# Altium schematic sheet Iso_SPI_PHY.SchDoc
size A4
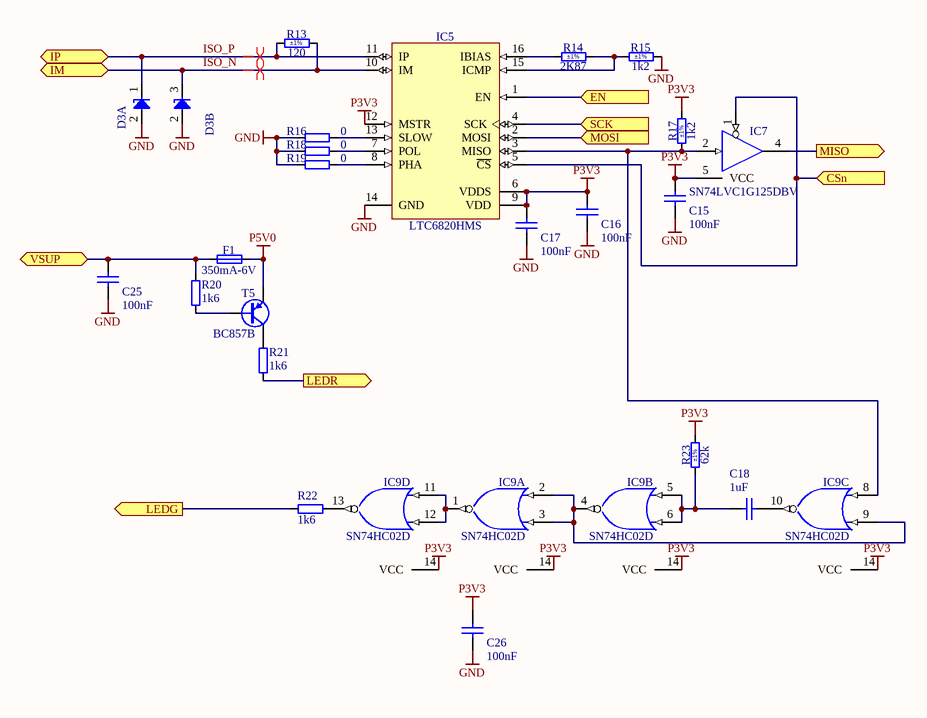
[diagram p0: Iso_SPI_PHY.SchDoc]

## Parts
C15  100nF  [CAPC1005X55N]
C16  100nF  [CAPC1005X55N]
C17  100nF  [CAPC1005X55N]
C18  1uF  [CAPC1608X87N]
C25  100nF  [CAPC1005X55N]
C26  100nF  [CAPC1005X55N]
D3  PESD3V3L5UY  [SOT65P210X110-6N]  (value not drawn)  (parts A,B of 5)
F1  350mA-6V  [FUSR_TYCO_MICROSMD035F]
IC5  LTC6820HMS  [SOP50P490X110-16N]
IC7  SN74LVC1G125DBV  [SOT95P280X145-5N]
IC9  SN74HC02D  [SOIC127P600X175-14N]  (parts A,B,C,D of 4)
R13  120  Tolerance: ±1%  [RESC1608X55N]
R14  2K87  Tolerance: ±1%  [RESC1005X40N]
R15  1k2  Tolerance: ±1%  [RESC1005X40N]
R16  0  [RESC1005X40N]
R17  1k2  Tolerance: ±1%  [RESC1005X40N]
R18  0  [RESC1005X40N]
R19  0  [RESC1005X40N]
R20  1k6  [RESC1005X40N]
R21  1k6  [RESC1005X40N]
R22  1k6  [RESC1005X40N]
R23  62k  Tolerance: ±1%  [RESC1608X55N]
T5  BC857B  [SOT95P230X110-3N]

## Ports
CSn (in), EN (in), IM (bidir), IP (bidir), LEDG (out), LEDR (out), MISO (out), MOSI (in), SCK (in), VSUP (bidir)

## Nets
GND: C15.1 C16.1 C17.1 C25.1 C26.1 D3.2(A) IC5.14(GND) IC7.3(GND) IC9.7(GND) R15.2 R16.1 R18.1 R19.1
P3V3: C15.2 C16.2 C17.2 C26.2 IC5.6(VDDS) IC5.9(VDD) IC5.12(MSTR) IC7.5(VCC) IC9.14(VCC) R17.2 R23.2
P5V0: F1.2 T5.2(E)
CSn: IC5.5(~{CS}) IC7.1(~{G}) ; port CSn
EN: IC5.1(EN) ; port EN
ISO_N: D3.3(C) IC5.10(IM) R13.2 ; port IM
ISO_P: D3.1(C) IC5.11(IP) R13.1 ; port IP
LEDG: R22.2 ; port LEDG
LEDR: R21.1 ; port LEDR
MISO: IC7.4(OUT) ; port MISO
MOSI: IC5.2(MOSI) ; port MOSI
SCK: IC5.4(SCK) ; port SCK
VSUP: C25.2 F1.1 R20.2 ; port VSUP
NetC18_1: C18.1 IC9.10(~{O})
NetC18_2: C18.2 IC9.5(A) IC9.6(B) R23.1
NetIC5_3: IC5.3(MISO) IC7.2(IN) IC9.8(A) R17.1
NetIC5_7: IC5.7(POL) R18.2
NetIC5_8: IC5.8(PHA) R19.2
NetIC5_13: IC5.13(SLOW) R16.2
NetIC5_15: IC5.15(ICMP) R14.2 R15.1
NetIC5_16: IC5.16(IBIAS) R14.1
NetIC9_1: IC9.1(~{O}) IC9.11(A) IC9.12(B)
NetIC9_2: IC9.2(A) IC9.3(B) IC9.4(~{O}) IC9.9(B)
NetIC9_13: IC9.13(~{O}) R22.1
NetR20_1: R20.1 T5.1(B)
NetR21_2: R21.2 T5.3(C)

## Layout directives
differential pair: ISO_N, ISO_P

## Library data of the parts
C15-C17 C25 C26 = CC0402_100NF_50V_10%_X7R: Non-polarised capacitor; Part Description: SMD Multilayer Chip Ceramic Capacitor; Manufacturer: GENERIC; Manufacturer1 Part Number: GRM155R71H104KE14D; Voltage: 50V; TC: X7R; Tolerance: ±10%; Part Number: CC0402_100NF_50V_10%_X7R; Component Kind: Standard; Component Type: Standard; Pin Count: 2; Value: 100nF; Status: None; Manufacturer Part Number: CC0402_100NF_50V_10%_X7R; Case: 0402; Mounted: Yes; Socket: No; SMD: Yes; Sense: No; Manufacturer1 Example: MURATA; Manufacturer1 ComponentHeight: 0.55mm; HelpURL: \\cern.ch\dfs\Applications\Altium\Datasheets\CC0402_MURATA_GRM155R71H104KE14D.pdf; Author: CERN DEM MR; CreateDate: 30.06.2017; LatestRevisionDate: 30.06.2017
C18 = CC0603_1UF_25V_10%_X7R: Non-polarised capacitor; Part Description: SMD Multilayer Chip Ceramic Capacitor; Manufacturer: GENERIC; Manufacturer1 Part Number: GRM188R71E105KA12D; Voltage: 25V; TC: X7R; Tolerance: ±10%; Part Number: CC0603_1UF_25V_10%_X7R; Component Kind: Standard; Component Type: Standard; Pin Count: 2; Value: 1uF; Status: None; Manufacturer Part Number: CC0603_1UF_25V_10%_X7R; Case: 0603; Mounted: Yes; Socket: No; SMD: Yes; Sense: No; Manufacturer1 Example: MURATA; Manufacturer1 ComponentHeight: 0.9mm; HelpURL: \\cern.ch\dfs\Applications\Altium\Datasheets\CC0603_X7R_MURATA.pdf; Author: CERN DEM JLC; CreateDate: 18.01.2011; LatestRevisionDate: 18.01.2011
D3 = PESD3V3L5UY: Fivefold ESD Protection Diode Arrays; Part Description: Fivefold ESD Protection Diode Arrays (30kV); Manufacturer: NEXPERIA; Voltage: 3.3V; Power: 200W; PressFit: No; Bonding: No; Part Number: PESD3V3L5UY; Component Kind: Standard; Component Type: Standard; Device: PESD3V3L5UY; PackageDescription: SOT363, SC-88, 0.65mm Pitch; 6 Pin, 1.25mm W X 2.00mm L X 1.10mm H body, IPC Medium Density; Manufacturer Part Number: PESD3V3L5UY; Pin Count: 6; Case: SOT363; Mounted: Yes; Socket: No; SMD: Yes; Sense: No; ComponentHeight: 1.1mm; HelpURL: \\cern.ch\dfs\Applications\Altium\Datasheets\PESD3V3L5UY.pdf; Author: CERN DEM WB; CreateDate: 05.07.2021; LatestRevisionDate: 05.07.2021
F1 = FUSR1210_TYCO_MICROSMD035F-2: Fuse; Part Description: PolySwitch®, PTC Resettable Fuse; Manufacturer: TYCO ELECTRONICS; PressFit: No; Part Number: FUSR1210_TYCO_MICROSMD035F-2; Component Kind: Standard; Component Type: Standard; Pin Count: 2; PackageDescription: PolySwitch, PTC Devices, 2-Leads, Body 3.215 x 2.575mm Nominal; Family: Fuses Resettable; Mounted: Yes; Socket: No; SMD: Yes; Sense: No; Status: Obsolete; Value: 350mA-6V; Manufacturer Part Number: microSMD035F-2; ComponentHeight: 0.62mm; HelpURL: \\cern.ch\dfs\Applications\Altium\Datasheets\FUSR_TYCO_microSMD035F-2.pdf; Author: CERN DEM JLC; CreateDate: 11.06.2012; LatestRevisionDate: 11.06.2012
IC5 = LTC6820HMS: isoSPI Isolated Communications Interface; Manufacturer: ANALOG DEVICES; PressFit: No; Bonding: No; Part Number: LTC6820HMS; Component Kind: Standard; Component Type: Standard; Device: LTC6820HMS; PackageDescription: SOP, 0.50mm Pitch; 16 Pin, 3.00mm W X 4.039mm L X 1.10mm H body, IPC Medium Density; Part Description: isoSPI Isolated Communications Interface; Manufacturer Part Number: LTC6820HMS; Pin Count: 16; Case: MSOP16; Mounted: Yes; Socket: No; SMD: Yes; Sense: No; ComponentHeight: 1.1mm; Author: CERN DEM BC; HelpURL: \\cern.ch\dfs\Applications\Altium\Datasheets\LTC6820HMS.pdf; CreateDate: 09.04.2020; LatestRevisionDate: 09.04.2020
IC7 = SN74LVC1G125DBV: Single Bus Buffer Gate With 3-State Output; Part Description: Single Bus Buffer Gate with 3-State Outputs; Manufacturer: TEXAS INSTRUMENTS; PressFit: No; Bonding: No; Part Number: SN74LVC1G125DBV; Component Kind: Standard; Component Type: Standard; Device: SN74LVC1G125DBV; PackageDescription: SOT, 0.95mm Pitch; 5 Pin, 1.60mm W X 2.90mm L X 1.45mm H body, IPC Medium Density; Manufacturer Part Number: SN74LVC1G125DBV; Pin Count: 5; Case: SOT23-5; Mounted: Yes; Socket: No; SMD: Yes; Sense: No; ComponentHeight: 1.45mm; Author: CERN DEM HF; HelpURL: \\cern.ch\dfs\Applications\Altium\Datasheets\SN74LVC1G125.pdf; CreateDate: 15.11.2022; LatestRevisionDate: 15.11.2022
IC9 = SN74HC02D: Quad 2-Input NOR Gate; Part Description: Quadruple 2-Input Positive-NOR Gate; Manufacturer: TEXAS INSTRUMENTS; PressFit: No; Bonding: No; Part Number: SN74HC02D; Component Kind: Standard; Component Type: Standard; Device: SN74HC02D; PackageDescription: SOIC 14, Pitch 1.27mm - Body 4x8.75mm, IPC Medium Density; Manufacturer Part Number: SN74HC02D; Pin Count: 14; Case: SOIC14; Mounted: Yes; Socket: No; SMD: Yes; Sense: No; ComponentHeight: 1.75mm; Author: CERN DEM JLC; HelpURL: \\cern.ch\dfs\Applications\Altium\Datasheets\SN74HC02D.pdf; CreateDate: 24.11.2008; LatestRevisionDate: 24.11.2008
R13 = R0603_120R_1%_0.1W_100PPM: Resistor - 1%; Part Description: General Purpose Thick Film Chip Resistor; Manufacturer: GENERIC; Manufacturer1 Part Number: NRC06F1200TRF; Power: 0.1W; TC: ±100ppm/°C; PressFit: No; Part Number: R0603_120R_1%_0.1W_100PPM; Component Kind: Standard; Component Type: Standard; Pin Count: 2; Value: 120; Status: Preferred; Manufacturer Part Number: R0603_120R_1%_0.1W_100PPM; Case: 0603; Mounted: Yes; Sense: No; Socket: No; SMD: Yes; Manufacturer1 Example: NIC COMPONENT; Manufacturer1 ComponentHeight: 0.55mm; HelpURL: \\cern.ch\dfs\Applications\Altium\Datasheets\R0603_NIC_NRC.pdf; Author: CERN DEM JLC; CreateDate: 03.12.2007; LatestRevisionDate: 13.03.2008
R14 = R0402_2K87_1%_0.063W_100PPM: Resistor - 1%; Part Description: General Purpose Thick Film Chip Resistor; Manufacturer: GENERIC; Manufacturer1 Part Number: CRCW04022K87FK; Power: 0.063W; TC: ±100ppm/°C; PressFit: No; Part Number: R0402_2K87_1%_0.063W_100PPM; Component Kind: Standard; Component Type: Standard; Pin Count: 2; Value: 2K87; Status: None; Manufacturer Part Number: R0402_2K87_1%_0.063W_100PPM; Case: 0402; Mounted: Yes; Sense: No; Socket: No; SMD: Yes; Manufacturer1 Example: VISHAY; Manufacturer1 ComponentHeight: 0.4mm; HelpURL: \\cern.ch\dfs\Applications\Altium\Datasheets\R0402_VISHAY_CRCW e3.pdf; Author: CERN DEM BC; CreateDate: 08.02.2021; LatestRevisionDate: 08.02.2021
R15 R17 = R0402_1K2_1%_0.0625W_100PPM: Resistor - 1%; Part Description: General Purpose Thick Film Chip Resistor; Manufacturer: GENERIC; Manufacturer1 Part Number: 232270671202L; TC: ±100ppm/°C; PressFit: No; Part Number: R0402_1K2_1%_0.0625W_100PPM; Component Kind: Standard; Component Type: Standard; Pin Count: 2; Value: 1k2; Status: Not Recommended; Power: 0.0625W; Manufacturer Part Number: R0402_1K2_1%_0.0625W_100PPM; Case: 0402; Mounted: Yes; Sense: No; Socket: No; SMD: Yes; Manufacturer1 Example: YAGEO PHYCOMP; Manufacturer1 ComponentHeight: 0.4mm; HelpURL: \\cern.ch\dfs\Applications\Altium\Datasheets\R0402_Phycomp_RC0402.pdf; Author: CERN DEM JLC; CreateDate: 03.12.2007; LatestRevisionDate: 17.10.2012
R16 R18 R19 = R0402_0R_JUMPER: Resistor; Part Description: 1A (0.05R Max DC Resistance) Zero Ohm Jumper; Manufacturer: GENERIC; Manufacturer1 Part Number: 232270591001L; PressFit: No; Part Number: R0402_0R_JUMPER; Component Kind: Standard; Component Type: Standard; Pin Count: 2; Value: 0; Status: Not Recommended; Manufacturer Part Number: R0402_0R_JUMPER; Case: 0402; Mounted: Yes; Sense: No; Socket: No; SMD: Yes; Manufacturer1 Example: YAGEO PHYCOMP; Manufacturer1 ComponentHeight: 0.4mm; HelpURL: \\cern.ch\dfs\Applications\Altium\Datasheets\R0402_Phycomp_RC0402.pdf; Author: CERN DEM JLC; CreateDate: 03.12.2007; LatestRevisionDate: 17.10.2012
R20-R22 = R0402_1K6_1%_0.0625W_100PPM: Resistor - 1%; Part Description: General Purpose Thick Film Chip Resistor; Manufacturer: GENERIC; Manufacturer1 Part Number: 232270671602L; TC: ±100ppm/°C; PressFit: No; Part Number: R0402_1K6_1%_0.0625W_100PPM; Component Kind: Standard; Component Type: Standard; Pin Count: 2; Value: 1k6; Status: Not Recommended; Power: 0.0625W; Tolerance: ±1%; Manufacturer Part Number: R0402_1K6_1%_0.0625W_100PPM; Case: 0402; Mounted: Yes; Sense: No; Socket: No; SMD: Yes; Manufacturer1 Example: YAGEO PHYCOMP; Manufacturer1 ComponentHeight: 0.4mm; HelpURL: \\cern.ch\dfs\Applications\Altium\Datasheets\R0402_Phycomp_RC0402.pdf; Author: CERN DEM JLC; CreateDate: 03.12.2007; LatestRevisionDate: 17.10.2012
R23 = R0603_62K_1%_0.1W_100PPM: Resistor - 1%; Part Description: General Purpose Thick Film Chip Resistor; Manufacturer: GENERIC; Manufacturer1 Part Number: NRC06F6202TRF; Power: 0.1W; TC: ±100ppm/°C; PressFit: No; Part Number: R0603_62K_1%_0.1W_100PPM; Component Kind: Standard; Component Type: Standard; Pin Count: 2; Value: 62k; Status: Preferred; Manufacturer Part Number: R0603_62K_1%_0.1W_100PPM; Case: 0603; Mounted: Yes; Sense: No; Socket: No; SMD: Yes; Manufacturer1 Example: NIC COMPONENT; Manufacturer1 ComponentHeight: 0.55mm; HelpURL: \\cern.ch\dfs\Applications\Altium\Datasheets\R0603_NIC_NRC.pdf; Author: CERN DEM JLC; CreateDate: 03.12.2007; LatestRevisionDate: 13.03.2008
T5 = BC857B: PNP Transistor; Part Description: 45V 100mA PNP general-purpose transistors; Manufacturer: NXP SEMICONDUCTORS; PressFit: No; Bonding: No; Part Number: BC857B; Component Kind: Standard; Component Type: Standard; Device: BC857B; PackageDescription: SOT23, 3 pin, Pitch 0.95mm - 1.3mm W X 2.9mm L X 1.1mm H, IPC Medium Density; Manufacturer Part Number: BC857B; Pin Count: 3; Case: SOT23-3; Mounted: Yes; Socket: No; SMD: Yes; Sense: No; ComponentHeight: 1.1mm; HelpURL: \\cern.ch\dfs\Applications\Altium\Datasheets\BC857B.pdf; Author: CERN DEM JLC; CreateDate: 14.06.2011; LatestRevisionDate: 14.06.2011